# EAGLE design node_with_dpl_and_relay (EAGLE 6.5.0)
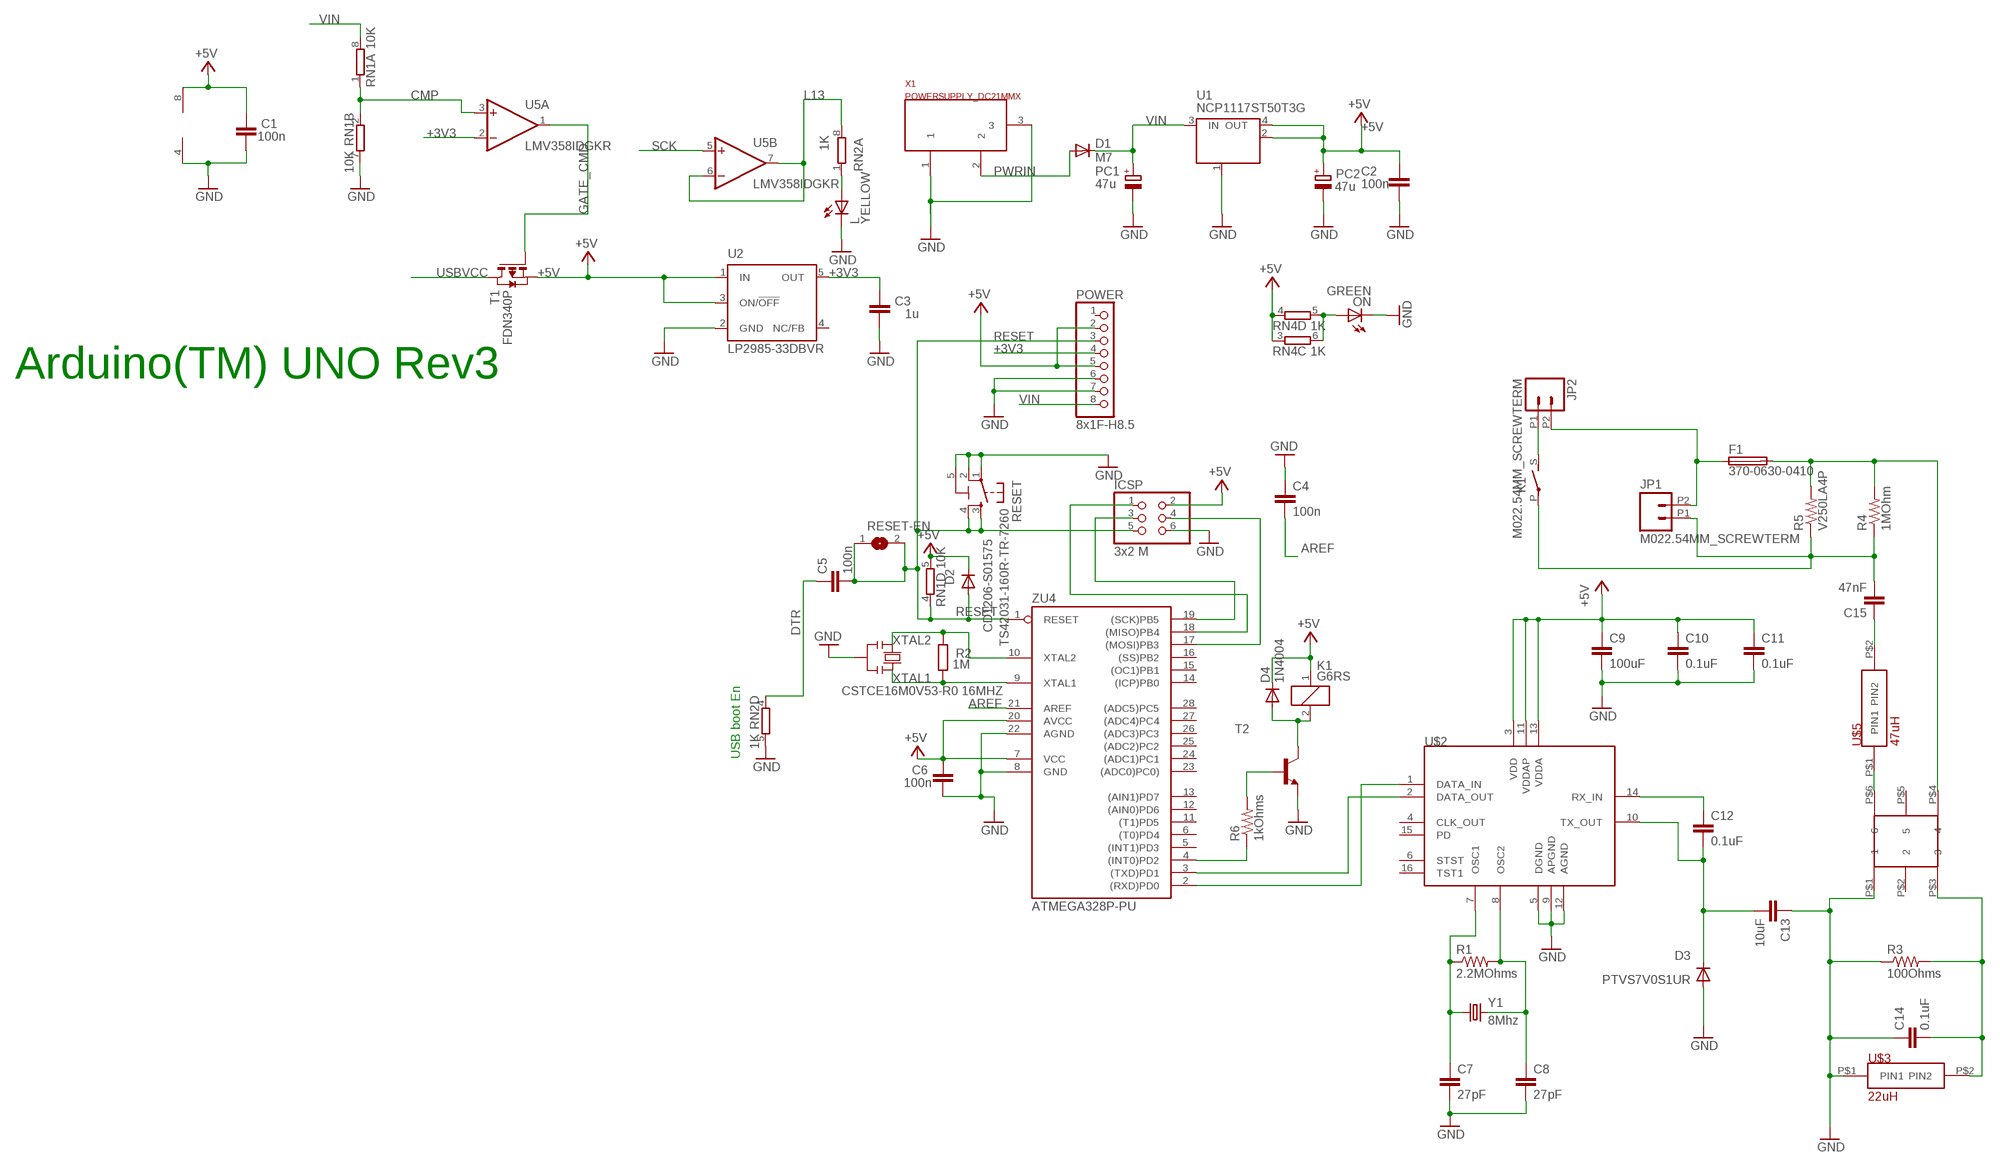
[diagram p0: schematic, sheet 1]

## Parts
C1  100n  C-EU0603-RND  [C0603-ROUND]
C2  100n  C-EU0603-RND  [C0603-ROUND]
C3  1u  C-EU0603-RND  [C0603-ROUND]
C4  100n  C-EU0603-RND  [C0603-ROUND]
C5  100n  C-EU0603-RND  [C0603-ROUND]
C6  100n  C-EU0603-RND  [C0603-ROUND]
C7  27pF  CAP1206  [1206]
C8  27pF  CAP1206  [1206]
C9  100uF  CAP1206  [1206]
C10  0.1uF  CAP1206  [1206]
C11  0.1uF  CAP1206  [1206]
C12  0.1uF  CAP_  [AXIAL-5MM]
C13  10uF  CAPPTH  [CAP-PTH-SMALL]
C14  0.1uF  CAP1206  [1206]
C15  47nF  C15/5  [C15B5]
D1  M7  DIODE-SMB  [SMB]
D2  CD1206-S01575  DIODE-MINIMELF  [MINIMELF]
D3  PTVS7V0S1UR  CGRM4001-G  [SOD-123_MINI-SMA]
D4  1N4004  [DO41-10]
F1  370-0630-0410  TR5  [TR5]
ICSP  3x2 M  PINHD-2X3  [2X03]
JP1  M022.54MM_SCREWTERM  [1X02_2.54_SCREWTERM]
JP2  M022.54MM_SCREWTERM  [1X02_2.54_SCREWTERM]
K1  G6RS  [G6RS]
L  YELLOW  LEDCHIP-LED0805  [CHIP-LED0805]
ON  GREEN  LEDCHIP-LED0805  [CHIP-LED0805]
PC1  47u  CPOL-EUD  [PANASONIC_D]
PC2  47u  CPOL-EUD  [PANASONIC_D]
POWER  8x1F-H8.5  PINHD-1X8  [1X08]
R1  2.2MOhms  RESISTOR1206  [1206]
R2  1M  R-EU_R0603  [R0603-ROUND]
R3  100Ohms  RESISTORPTH-1/2W  [AXIAL-0.5]
R4  1MOhm  10KOHM1/6W5%(PTH)KIT  [AXIAL-0.3-KIT]
R5  V250LA4P  RESISTORPTH-1/4W  [AXIAL-0.4]
R6  1kOhms  R-US_0204/2V  [0204V]
RESET  TS42031-160R-TR-7260  TS42  [TS42]
RESET-EN  SJ  [SJ]
RN1  10K  4R-NCAY16  [CAY16]
RN2  1K  4R-NCAY16  [CAY16]
RN4  1K  4R-NCAY16  [CAY16]
T1  FDN340P  PMOSSOT23  [SOT-23]
T2  2N5401-NPN-TO92-CBE  [TO92-CBE]
U1  NCP1117ST50T3G  MC33269ST-3.3T3  [SOT223]
U2  LP2985-33DBVR  LP2985-XXDBVR33  [SOT23-DBV]
U5  LMV358IDGKR  LMV358MMX  [MSOP08]
U$2  TDA5052AT  [SO16L]
U$3  22uH  RFB0807-220L  [RFB0807-220L]
U$4  78250MC  [78250MC]
U$5  47uH  RFB0807-220L  [RFB0807-220L]
X1  POWERSUPPLY_DC21MMX  [POWERSUPPLY_DC-21MM]
Y1  8Mhz  CRYSTALHC49US  [HC49US]
Y2  CSTCE16M0V53-R0 16MHZ  RESONATORMU  [RESONATOR]
ZU4  ATMEGA328P-PU  [DIL28-3]

## Nets
+3V3: C3.2 POWER.4 U2.5(OUT) U5.2(A:-IN)
+5V [usbvcc]: C1.2 C2.2 C6.2 C9.1 C10.1 C11.1 D2.C D4.C ICSP.2 K1.1 PC2.+ POWER.2 POWER.5 RN1.5 RN4.3 RN4.4 T1.2(S) U1.2(OUT) U1.4(OUT) U2.1(IN) U2.3(ON/!OFF) U5.8(P:V+) U$2.3(VDD) U$2.11(VDDAP) U$2.13(VDDA) ZU4.7(VCC) ZU4.20(AVCC)
AREF [aref]: C4.2 ZU4.21(AREF)
CMP: RN1.1 RN1.2 U5.3(A:+IN)
DTR: C5.1 RN2.4
GATE_CMD: T1.3(G) U5.1(A:OUT)
GND [gnd]: C1.1 C2.1 C3.1 C4.1 C6.1 C7.2 C8.2 C9.2 C10.2 C11.2 C13.1 C14.1 D3.A ICSP.6 L.C ON.C PC1.- PC2.- POWER.6 POWER.7 R3.P$1 RESET.1 RESET.2 RESET.5(5-GND) RN1.7 RN2.5 T2.E U1.1(GND/ADJ) U2.2(GND) U5.4(P:V-) U$2.5(DGND) U$2.9(APGND) U$2.12(AGND) U$3.P$1(PIN1) U$4.P$1 X1.1 X1.3 Y2.2 ZU4.8(GND) ZU4.22(AGND)
L13: RN2.8 U5.6(B:-IN) U5.7(B:OUT)
MISO: ICSP.1 ZU4.18((MISO)PB4)
MOSI: ICSP.4 ZU4.17((MOSI)PB3)
N$1: L.A RN2.1
N$2: C8.1 R1.2 U$2.8(OSC2) Y1.2
N$3: ON.A RN4.5 RN4.6
N$4: C7.1 R1.1 U$2.7(OSC1) Y1.1
N$5: C12.P$1 U$2.14(RX_IN)
N$6: C12.P$2 C13.2 D3.C U$2.10(TX_OUT)
N$7: C14.2 R3.P$2 U$3.P$2(PIN2) U$4.P$3
N$8: U$4.P$6 U$5.P$1(PIN1)
N$9: C15.1 U$5.P$2(PIN2)
N$10: F1.2 R4.P$2 R5.P$2 U$4.P$4
N$11: JP2.P1 K1.S(2:S)
N$12: F1.1 JP1.P2 JP2.P2
N$13: U$2.2(DATA_OUT) ZU4.3((TXD)PD1)
N$14: U$2.1(DATA_IN) ZU4.2((RXD)PD0)
N$15: R6.1 ZU4.4((INT0)PD2)
N$16: R6.2 T2.B
N$17: D4.A K1.2 T2.C
N$19: C15.2 JP1.P1 K1.P(2:P) R4.P$1 R5.P$1
PWRIN [power]: D1.A X1.2
RESET: C5.2 D2.A ICSP.5 POWER.3 RESET-EN.1 RESET-EN.2 RESET.3 RESET.4 RN1.4 ZU4.1(RESET)
SCK: ICSP.3 U5.5(B:+IN) ZU4.19((SCK)PB5)
USBVCC [usbvcc]: T1.1(D)
VIN [power]: D1.C PC1.+ POWER.8 RN1.8 U1.3(IN)
XTAL1: R2.1 Y2.3 ZU4.9(XTAL1)
XTAL2: R2.2 Y2.1 ZU4.10(XTAL2)
Unconnected: POWER.1 RN1.3 RN1.6 RN2.2 RN2.3 RN2.6 RN2.7 RN4.1 RN4.2 RN4.7 RN4.8 U2.4(NC/FB) U$2.4(CLK_OUT) U$2.6(STST) U$2.15(PD) U$2.16(TST1) U$4.P$2 U$4.P$5 ZU4.5((INT1)PD3) ZU4.6((T0)PD4) ZU4.11((T1)PD5) ZU4.12((AIN0)PD6) ZU4.13((AIN1)PD7) ZU4.14((ICP)PB0) ZU4.15((OC1)PB1) ZU4.16((SS)PB2) ZU4.23((ADC0)PC0)) ZU4.24((ADC1)PC1) ZU4.25((ADC2)PC2) ZU4.26((ADC3)PC3) ZU4.27((ADC4)PC4) ZU4.28((ADC5)PC5)

## Notes on the sheet
- Arduino(TM) UNO Rev3
- USB boot En

## Library data of the parts
C1-C6 = SmartPrj:C-EU: CAPACITOR, European symbol
C7-C12 C14 = SparkFun-Passives:CAP: Capacitor Standard 0603 ceramic capacitor, and 0.1" leaded capacitor.
C13 = SparkFun-Capacitors:CAP: Capacitor Standard 0603 ceramic capacitor, and 0.1" leaded capacitor.
C15 = capacitor-wima:C: CAPACITOR naming: grid - package width
D1 D2 = diode:DIODE-: DIODE
D3 = diode:CGRM400*-G: Molded plasitc,JEDEC SOD-123/Mini SMA Source: Comchip CGRM4001-G.pdf
D4 = diode:1N4004: DIODE general purpose rectifier, 1 A
F1 = fuse:TR5: FUSE Wickmann; OC_FARNELL: unknown; OC_NEWARK: unknown
ICSP = SmartPrj:PINHD-2X3: PIN HEADER
JP1 JP2 = SparkFun-Connectors:M02: Standard 2-pin 0.1" header. Use with - straight break away headers ( PRT-00116) - right angle break away headers (PRT-00553) - swiss pins (PRT-00743) - machine pins (PRT-00117) - female headers (PRT-00115) Molex polarized connector foot print use with: PRT-08233 with associated crimp pins and housings. 2.54_SCREWTERM for use with PRT-10571. 3.5mm Screw Terminal footprints for PRT-08084 5mm Screw Terminal footprints for use with PRT-08433
K1 = relay:G6RS: RELAY 1 x norm. open, Omron; OC_FARNELL: unknown; OC_NEWARK: unknown
L ON = led:LED: LED OSRAM: - CHIPLED LG R971, LG N971, LY N971, LG Q971, LY Q971, LO R971, LY R971 LH N974, LH R974 LS Q976, LO Q976, LY Q976 LO Q996 - Hyper CHIPLED LW Q18S LB Q993, LB Q99A, LB R99A - SideLED LS A670, LO A670, LY A670, LG A670, LP A670 LB A673, LV A673, LT A673, LW A673 LH A674 LY A675 LS A676, LA A676, LO A676, LY A676, LW A676 LS A679, LY A679, LG A679 - Hyper Micro SIDELED® LS Y876, LA Y876, LO Y876, LY Y876 LT Y87S - SmartLED LW L88C, LW L88S LB L89C, LB L89S, LG L890 LS L89K, LO L89K, LY L89K LS L896, LA L896, LO L896, LY L896 - TOPLED LS T670, LO T670, LY T670, LG T670, LP T670 LSG T670, LSP T670, LSY T670, LOP T670, LYG T670 LG T671, LOG T671, LSG T671 LB T673, LV T673, LT T673, LW T673 LH T674 LS T676, LA T676, LO T676, LY T676, LB T676, LH T676, LSB T676, LW T676 LB T67C, LV T67C, LT T67C, LS T67K, LO T67K, LY T67K, LW E67C LS E67B, LA E67B, LO E67B, LY E67B, LB E67C, LV E67C, LT E67C LW T67C LS T679, LY T679, LG T679 LS T770, LO T770, LY T770, LG T770, LP T770 LB T773, LV T773, LT T773, LW T773 LH T774 LS E675, LA E675, LY E675, LS T675 LS T776, LA T776, LO T776, LY T776, LB T776 LHGB T686 LT T68C, LB T68C - Hyper Mini TOPLED® LB M676 - Mini TOPLED Santana® LG M470 LS M47K, LO M47K, LY M47K Source: http://www.osram.convergy.de LUXEON: - LUMILED® LXK2-PW12-R00, LXK2-PW12-S00, LXK2-PW14-U00, LXK2-PW14-V00 LXK2-PM12-R00, LXK2-PM12-S00, LXK2-PM14-U00 LXK2-PE12-Q00, LXK2-PE12-R00, LXK2-PE12-S00, LXK2-PE14-T00, LXK2-PE14-U00 LXK2-PB12-K00, LXK2-PB12-L00, LXK2-PB12-M00, LXK2-PB14-N00, LXK2-PB14-P00, LXK2-PB14-Q00 LXK2-PR12-L00, LXK2-PR12-M00, LXK2-PR14-Q00, LXK2-PR14-R00 LXK2-PD12-Q00, LXK2-PD12-R00, LXK2-PD12-S00 LXK2-PH12-R00, LXK2-PH12-S00 LXK2-PL12-P00, LXK2-PL12-Q00, LXK2-PL12-R00 Source: www.luxeon.com KINGBRIGHT: KA-3528ASYC Source: www.kingbright.com
PC1 PC2 = rcl:CPOL-EU: POLARIZED CAPACITOR, European symbol
POWER = SmartPrj:PINHD-1X8: PIN HEADER
R1 R5 = SparkFun-Passives:RESISTOR: Resistor Basic schematic elements and footprints for 0603, 1206, and PTH resistors.
R2 = SmartPrj:R-EU_: RESISTOR, European symbol
R3 = SparkFun-Resistors:RESISTOR: Resistor Basic schematic elements and footprints for 0603, 1206, and PTH resistors.
R4 = SparkFun-Resistors:10KOHM1/6W5%(PTH): RES-08375; PROD_ID: RES-08375
R6 = resistor:R-US_: RESISTOR, American symbol
RESET = SmartPrj:TS42: TS42 Dongnan Electronics Tact switch VDC 12V - 50mA
RESET-EN = jumper:SJ: SMD solder JUMPER
RN1 RN2 RN4 = resistor-dil:4R-N: Array Chip Resistor Source: RS Component / Phycomp
T1 = zetex:PMOSSOT23: MOS FET
T2 = transistor:*-NPN-: NPN Transistror BF959 corrected 2008.03.06
U1 = linear:MC33269ST*: Adjustable Output Low Dropout Voltage Regulator 800 mA Source: http://www.onsemi.com/pub/Collateral/MC33269-D.PDF
U2 = SmartPrj:LP2985-XXDBVR: ULTRALOW-POWER 50-mA LOW-DROPOUT LINEAR REGULATORS 50-mA Low-Dropout Regulator Source: http://focus.ti.com/lit/ds/symlink/tps77001.pdf
U5 = linear:LMV358?*: Dual General Purpose, Low Voltage, Rail-to-Rail Output Operational Amplifiers Source: http://www.national.com/mpf/LM/LMV321.html http://www.national.com/dt/lmv_qual.pdf
U$2 = Power_Modem:TDA5052AT
U$3 U$5 = Coilcraft_Inductors:RFB0807-220L
U$4 = Murata_Transformers:78250MC
X1 = SmartPrj:POWERSUPPLY_DC21MM
Y1 = SparkFun-FreqCtrl:CRYSTAL: Various standard crystals. Proven footprints. Spark Fun Electronics SKU : COM-00534
Y2 = SmartPrj:RESONATOR
ZU4 = SmartPrj:ATMEGA328P-: MICROCONTROLLER 4 Kbytes FLASH 128 bytes SRAM 256 bytes EEPROM UART 6-channel 10 bit ADC

## Net classes
0 default: width 0.254 mm, clearance 0.254 mm
1 power: width 0.61 mm, drill 0.61 mm, clearance 0.254 mm
2 gnd: width 0.305 mm, drill 0.559 mm, clearance 0.254 mm
3 usbvcc: width 0.508 mm, drill 0.61 mm, clearance 0.254 mm
4 aref: width 0.406 mm, drill 0.61 mm, clearance 0.254 mm

## Board
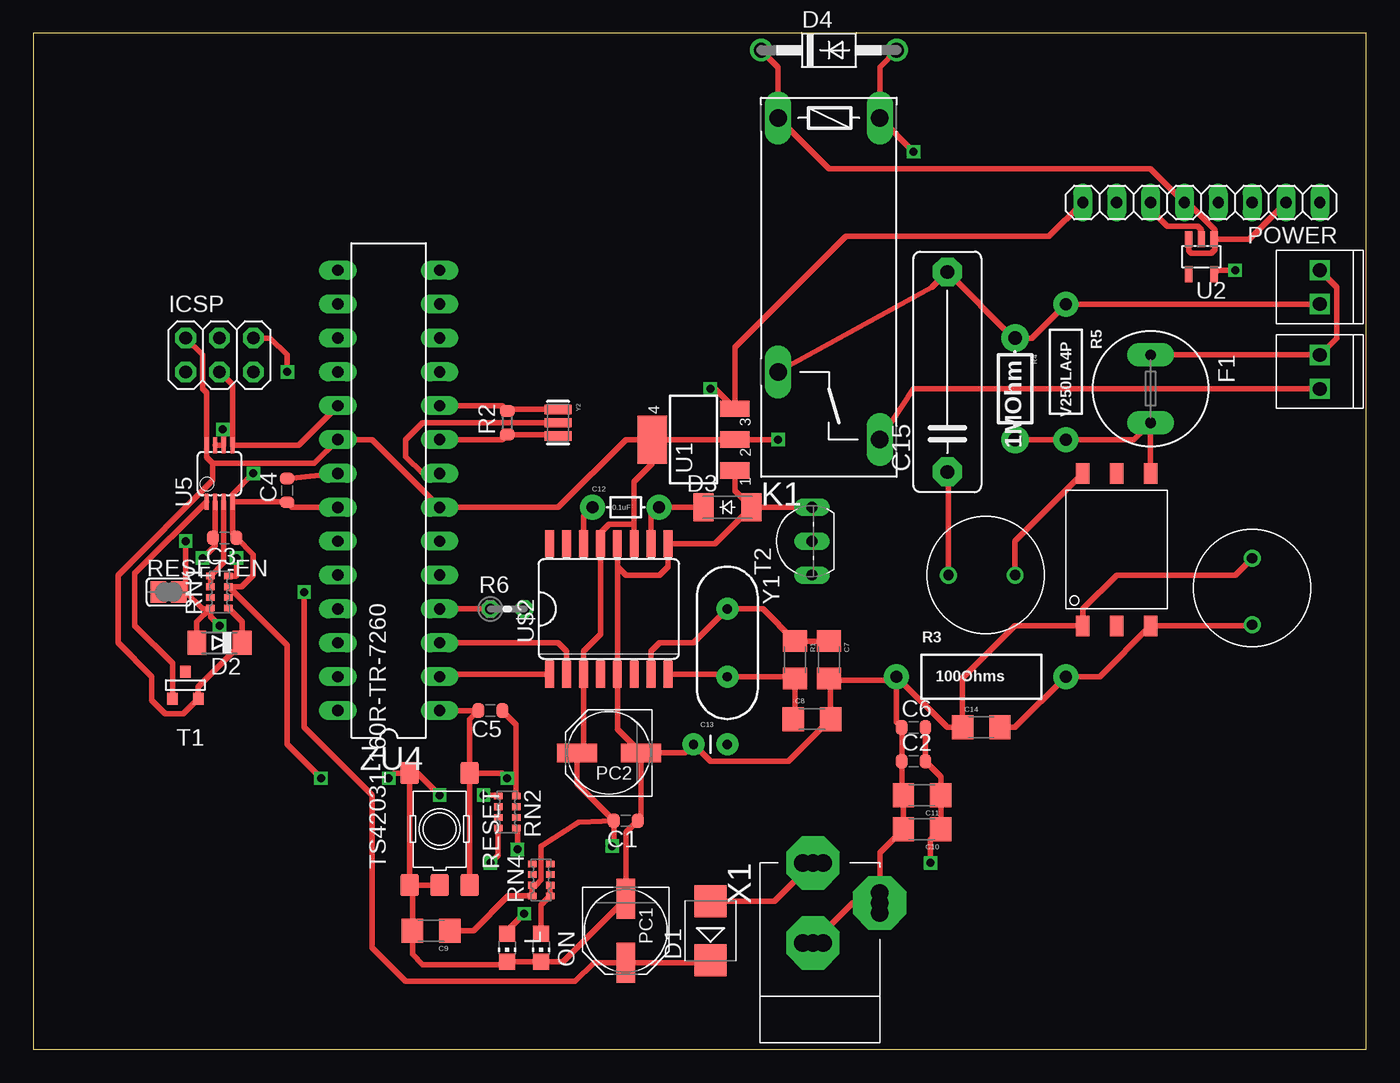
[diagram p1: board, top side]
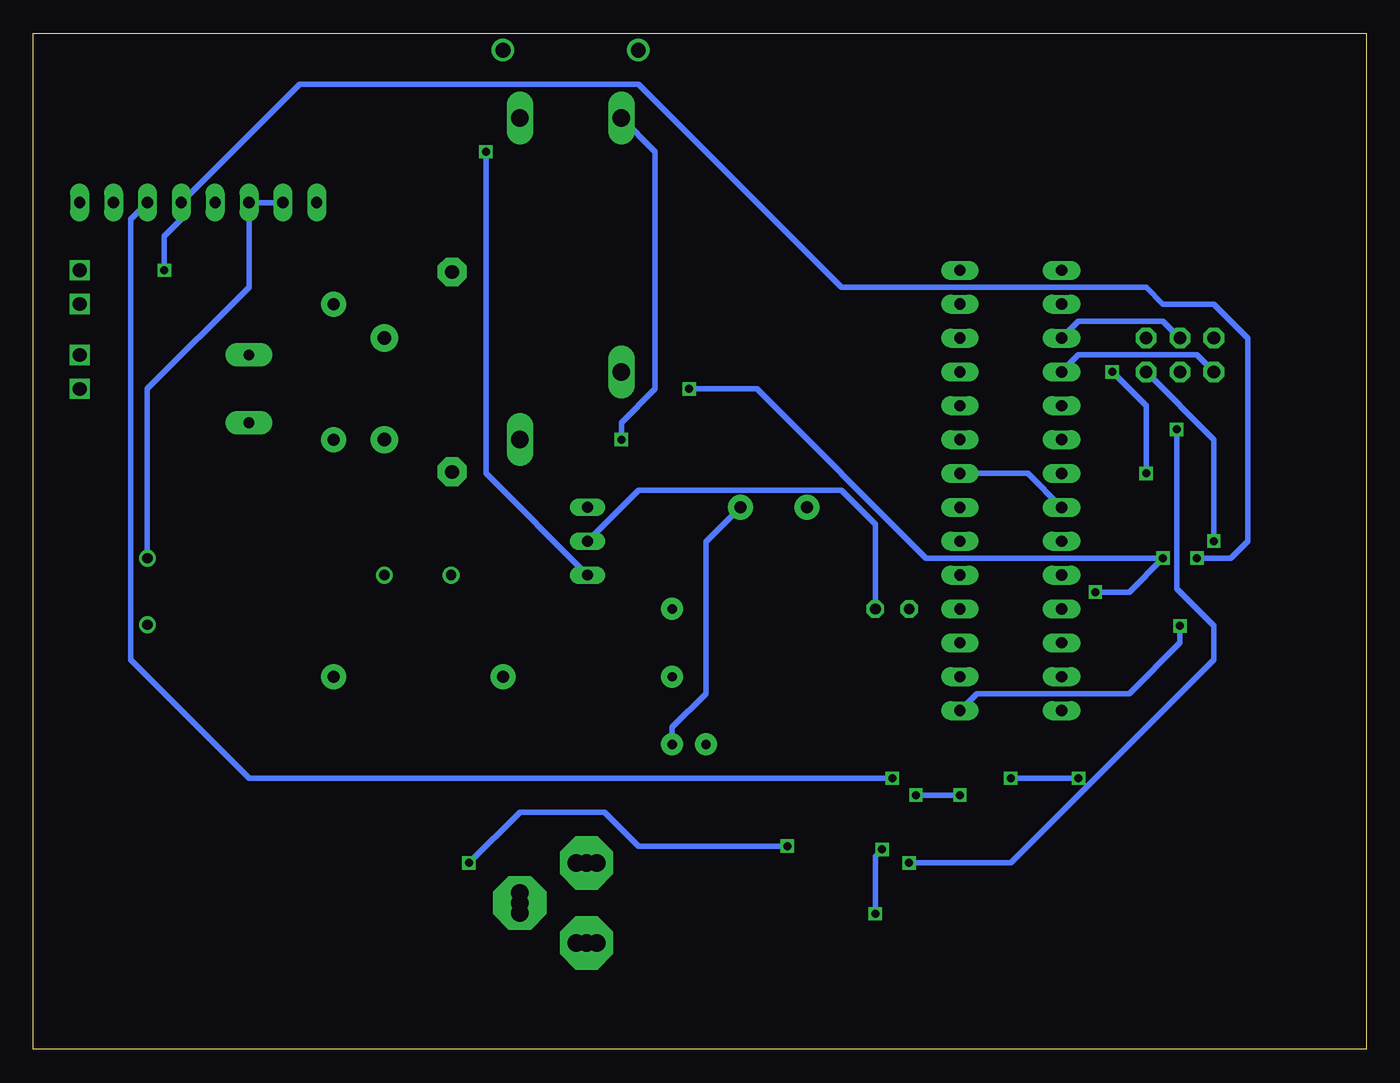
[diagram p2: board, bottom side, seen from below]

Size 100 x 76.19 mm. Coordinates in mm from the lower left corner, seen from the top.
Outline: 0,0 100,0 100,76.19 0,76.19 0,0
Copper layers (1*16): Top 0.035mm / dielectric 1.5mm / Bottom 0.035mm
Design rules "default": minimum track width 10mil, minimum drill 24mil, track to track 8mil, track to pad 8mil, pad to pad 8mil, via to via 8mil, smd to smd 8mil, copper to edge 40mil, drill to drill 8mil, minimum pad ring 10mil, minimum via ring 8mil, stop-mask expansion 4mil, vias tented up to drill 0mil, thermal gap 10mil

### Footprints (pad centres in the part's own frame; a part is rotated, then mirrored left to right if it is on the bottom)
C0603-ROUND = smd 0.898 x 1.1: 1 -0.889,0; 2 0.889,0
1206 = smd 1.6 x 1.8: 1 -1.4,0; 2 1.4,0
AXIAL-5MM = drill 0.9 pad 1.88: P$1 -2.5,0; P$2 2.5,0
CAP-PTH-SMALL = drill 0.7 pad 1.651: 1 0,0; 2 2.54,0
C15B5 = drill 1.016 pad 2.159 octagon: 1 -7.493,0; 2 7.493,0
SMB = smd 2.4 x 2.4: A 2.2,0; C -2.2,0
MINIMELF = smd 1.4 x 1.8: A 1.7,0; C -1.7,0
SOD-123_MINI-SMA = smd 1.5 x 2.1: A 1.8,0; C -1.8,0
DO41-10 = drill 1.118: A 5.08,0; C -5.08,0
TR5 = drill 0.813 pad 1.778 long: 1 -2.54,0; 2 2.54,0
2X03 = drill 0.95 pad 1.55 octagon: 1 -2.54,-1.27; 2 -2.54,1.27; 3 0,-1.27; 4 0,1.27; 5 2.54,-1.27; 6 2.54,1.27
1X02_2.54_SCREWTERM = drill 1.016 square: P1 2.54,0; P2 0,0
G6RS = drill 1.321 long: 1 -12.7,-3.81; 2 -12.7,3.81; P 6.35,-3.81; S 11.43,3.81
CHIP-LED0805 = smd 1.2 x 1.2: A 0,-1.05; C 0,1.05
PANASONIC_D = smd 3 x 1.4: + 2.4,0; - -2.4,0
1X08 = drill 0.85 pad 1.422 long: 1 -8.89,0; 2 -6.35,0; 3 -3.81,0; 4 -1.27,0; 5 1.27,0; 6 3.81,0; 7 6.35,0; 8 8.89,0
R0603-ROUND = smd 0.898 x 1.1: 1 -0.889,0; 2 0.889,0
AXIAL-0.5 = drill 0.9 pad 1.88: P$1 -6.35,0; P$2 6.35,0
AXIAL-0.3-KIT = drill 1.016 pad 2.032: P$1 -3.81,0; P$2 3.81,0
AXIAL-0.4 = drill 0.9 pad 1.88: P$1 -5.08,0; P$2 5.08,0
0204V = drill 0.813 octagon: 1 -1.27,0; 2 1.27,0
TS42 = smd 1.6 x 1.4: 1 -4.2,2.25; 2 4.2,2.25; 3 -4.2,-2.25; 4 4.2,-2.25; 5 -4.2,0
SJ = smd 1.168 x 1.6: 1 -0.762,0; 2 0.762,0
CAY16 = smd 0.5 x 0.65: 1 -1.2,-0.675; 2 -0.4,-0.675; 3 0.4,-0.675; 4 1.2,-0.675; 5 1.2,0.675; 6 0.4,0.675; 7 -0.4,0.675; 8 -1.2,0.675
SOT-23 = smd 0.787 x 0.889: 1 0.025,-1.016; 2 -0.94,1.016; 3 0.991,1.016
TO92-CBE = drill 0.813 long: B 0,0; C -2.54,0; E 2.54,0
SOT223 = smd 1.219 x 2.235: 1 -2.311,-3.099; 2 0,-3.099; 3 2.311,-3.099 | smd 3.6 x 2.2: 4 0,3.099
SOT23-DBV = smd 0.55 x 1.2: 1 -0.95,-1.3; 2 0,-1.3; 3 0.95,-1.3; 4 0.95,1.3; 5 -0.95,1.3
MSOP08 = smd 0.3 x 1.2: 1 -0.976,-2.113; 2 -0.326,-2.113; 3 0.324,-2.113; 4 0.974,-2.113; 5 0.974,2.112; 6 0.324,2.112; 7 -0.326,2.112; 8 -0.976,2.112
SO16L = smd 0.66 x 2.032: 1 -4.445,-4.902; 2 -3.175,-4.902; 3 -1.905,-4.902; 4 -0.635,-4.902; 5 0.635,-4.902; 6 1.905,-4.902; 7 3.175,-4.902; 8 4.445,-4.902; 9 4.445,4.902; 10 3.175,4.902; 11 1.905,4.902; 12 0.635,4.902; 13 -0.635,4.902; 14 -1.905,4.902; 15 -3.175,4.902; 16 -4.445,4.902
RFB0807-220L = drill 0.762: P$1 0,0; P$2 5.004,0
78250MC = smd 1.524 x 1.016: P$1 0,0; P$2 0,-2.54; P$3 0,-5.08; P$4 11.43,-5.08; P$5 11.43,-2.54; P$6 11.43,0
POWERSUPPLY_DC-21MM = drill 1.3 pad 4 octagon: 1 -5.08,-3.353; 2 -0.076,-6.35; 3 -0.076,-0.356 | drill 1.3: 4 -5.08,-4.115; 5 -5.08,-2.591; 6 -0.838,-0.356; 7 0.686,-0.356; 8 -0.838,-6.35; 9 0.686,-6.35
HC49US = drill 0.7 pad 1.651: 1 -2.54,0; 2 2.54,0
RESONATOR = smd 0.7 x 2: 1 -1,0; 2 0,0; 3 1,0
DIL28-3 = drill 0.85 pad 1.422 long: 1 -16.51,-3.81; 2 -13.97,-3.81; 3 -11.43,-3.81; 4 -8.89,-3.81; 5 -6.35,-3.81; 6 -3.81,-3.81; 7 -1.27,-3.81; 8 1.27,-3.81; 9 3.81,-3.81; 10 6.35,-3.81; 11 8.89,-3.81; 12 11.43,-3.81; 13 13.97,-3.81; 14 16.51,-3.81; 15 16.51,3.81; 16 13.97,3.81; 17 11.43,3.81; 18 8.89,3.81; 19 6.35,3.81; 20 3.81,3.81; 21 1.27,3.81; 22 -1.27,3.81; 23 -3.81,3.81; 24 -6.35,3.81; 25 -8.89,3.81; 26 -11.43,3.81; 27 -13.97,3.81; 28 -16.51,3.81

### Placement (x,y rotation side)
C1  44.45,17.14 180 top
C2  66.04,21.59 0 top
C3  14.35,38.35 180 top
C4  19.05,41.91 90 top
C5  34.29,25.4 180 top
C6  66.04,24.13 0 top
C7  59.69,29.21 270 top
C8  58.42,24.77 0 top
C9  29.84,8.89 180 top
C10  66.67,16.51 180 top
C11  66.67,19.05 180 top
C12  44.45,40.64 0 top
C13  49.53,22.86 0 top
C14  71.12,24.13 0 top
C15  68.58,50.8 90 top
D1  50.8,8.89 90 top
D2  13.97,30.48 180 top
D3  52.07,40.64 0 top
D4  59.69,74.93 0 top
F1  83.82,49.53 270 top
ICSP  13.97,52.07 0 top
JP1  96.52,58.42 270 top
JP2  96.52,52.07 270 top
K1  59.69,57.15 270 top
L  35.56,7.62 180 top
ON  38.1,7.62 180 top
PC1  44.45,8.89 270 top
PC2  43.18,22.22 180 top
POWER  87.63,63.5 180 top
R1  57.15,29.21 270 top
R2  35.56,46.99 90 top
R3  71.12,27.94 0 top
R4  73.66,49.53 270 top
R5  77.47,50.8 270 top
R6  35.56,33.02 0 top
RESET  30.48,16.51 90 top
RESET-EN  10.16,34.29 0 top
RN1  13.97,34.29 270 top
RN2  35.56,17.78 90 top
RN4  38.1,12.7 270 top
T1  11.43,27.3 180 top
T2  58.42,38.1 90 top
U1  49.53,45.72 90 top
U2  87.63,59.44 180 top
U5  13.97,43.18 0 top
U$2  43.18,33.02 0 top
U$3  91.44,36.83 270 top
U$4  78.74,31.75 90 top
U$5  73.66,35.56 180 top
X1  58.42,7.62 180 top
Y1  52.07,30.48 270 top
Y2  39.37,46.99 270 top
ZU4  26.67,41.91 90 top

### Tracks (layer width: path | path; a pad name or v marks a point on that pad's centre or on a via)
+3V3  (via drill 0.6)
  Top 0.406: C3.2 13.64,38.54 U5.2 13.64,37.77 v12.7,36.83 | v90.17,58.42 88.86,58.42 U2.5
  Bottom 0.406: v90.17,58.42 90.17,60.96 88.9,62.23 POWER.4 80.01,72.39 54.61,72.39 39.37,57.15 16.51,57.15 15.24,55.88 11.43,55.88 8.89,53.34 8.89,38.1 10.16,36.83 v12.7,36.83
+5V  (via drill 0.6)
  Top 0.406: U1.4 U1.2 v55.88,45.72 | U1.4 46.43,43.89 45.08,42.55 45.08,39.37 | 45.08,39.37 U$2.11 | U1.4 44.45,45.72 39.37,40.64 ZU4.7 25.4,45.72 ZU4.20 21.08,43.94 13.46,43.94 | 45.08,39.37 43.18,39.37 42.54,38.73 U$2.13 42.54,31.11 41.27,29.84 U$2.3 41.27,22.72 PC2.+ 40.78,19.93 C1.2 | C9.1 33.02,8.89 35.63,11.5 RN4.4 RN4.3 37.7,12.3 38.1,12.7 38.1,15.24 40.89,17.02 C1.2 | C6.2 C2.2 68.08,20.44 C11.1 C10.1 67.31,15.75 v67.31,13.97 | D4.C 55.88,73.66 K1.1 59.69,66.04 83.82,66.04 POWER.5 86.61,63.5 88.65,61.47 88.65,60.8 U2.1 | RN1.5 15.67,32.06 D2.C 12.37,27.18 T1.2 11.23,25.15 9.91,25.15 8.89,26.16 8.89,27.94 6.35,30.48 6.35,35.56 13.46,42.67 13.46,43.94 | 13.46,43.94 12.99,44.41 U5.8 12.99,49.24 12.7,49.53 12.7,52.07 ICSP.2 | U2.3 86.68,59.88 86.87,59.69 88.39,59.69 88.65,59.94 88.65,60.67 U2.1 | U2.1 91.22,60.74 POWER.2 | C1.2 43.56,15.37 v43.43,15.24
  Bottom 0.406: v55.88,45.72 55.88,46.99 53.34,49.53 53.34,67.31 K1.1 | v43.43,15.24 54.61,15.24 57.15,17.78 63.5,17.78 v67.31,13.97
AREF
  Top 0.406: C4.2 ZU4.21
CMP
  Top 0.406: U5.3 14.29,36.49 RN1.1 RN1.2
DTR
  Top 0.406: RN2.4 36.23,24.34 C5.1
GATE_CMD
  Top 0.406: T1.3 10.44,28.93 7.62,31.75 7.62,35.69 U5.1
GND  (via drill 0.6)
  Top 0.406: D3.A 51.15,37.92 U$2.9 47.62,36.2 46.99,35.56 44.45,35.56 43.81,36.2 U$2.12 U$2.5 43.81,23.99 PC2.- | U1.1 52.63,41.88 D3.A | PC2.- 45.58,17.39 C1.1 44.45,16.26 PC1.- 39.73,6.57 ON.C L.C 35.34,6.35 29.21,6.35 28.45,7.12 C9.2 28.45,12.09 | PC2.- 48.89,22.22 C13.1 50.8,21.59 56.64,21.59 C8.2 59.82,27.68 | 59.82,27.68 C7.2 | ZU4.22 19.43,40.64 C4.1 19,41.07 U5.4 | 28.45,12.09 RESET.1 RESET.2 | 59.82,27.68 64.51,27.68 R3.P$1 | R3.P$1 64.77,24.51 C6.1 C2.1 65.15,19.17 C11.2 C10.2 63.5,14.73 X1.1 61.49,10.97 X1.3 | R3.P$1 68.58,24.13 C14.1 69.72,27.81 73.66,31.75 U$4.P$1 78.74,33.02 81.28,35.56 90.17,35.56 U$3.P$1 | D3.A T2.E | U5.4 14.94,38.65 C3.1 16.51,37.08 16.51,35.56 15.64,34.69 RN1.7 19.05,30.29 19.05,22.86 v21.59,20.32 | POWER.6 83.82,62.99 85.09,61.72 87.38,61.72 87.63,61.47 U2.2 | ZU4.8 29.21,43.18 27.94,44.45 27.94,45.72 29.21,46.99 Y2.2 | RESET.2 28.82,20.71 v30.48,19.05 | v33.78,19.05 34.81,19.05 RN2.5 | U5.4 14.94,41.61 v16.51,43.18 | v19.05,50.8 19.05,52.07 17.78,53.34 ICSP.6 | v26.67,20.32 27.06,20.71 RESET.2 | 28.45,12.09 28.66,12.31 RESET.5
  Bottom 0.406: U$3.P$1 91.44,49.53 83.82,57.15 POWER.6 POWER.7 | ZU4.8 25.4,43.18 ZU4.22 | v30.48,19.05 v33.78,19.05 | v16.51,43.18 16.51,48.26 v19.05,50.8 | v21.59,20.32 v26.67,20.32
L13  (via drill 0.6)
  Top 0.406: U5.7 U5.6 14.29,46.41 v14.22,46.48 | v34.29,13.97 34.88,14.57 RN2.8
  Bottom 0.406: v14.22,46.48 14.22,34.54 11.43,31.75 11.43,29.21 26.67,13.97 v34.29,13.97
MISO
  Bottom 0.406: ICSP.1 12.7,52.07 21.59,52.07 ZU4.18
MOSI
  Bottom 0.406: ICSP.4 15.24,54.61 21.59,54.61 ZU4.17
N$1  (via drill 0.6)
  Top 0.406: L.A 35.56,8.89 v36.83,10.16 | v36.32,14.99 36.32,16.49 RN2.1
  Bottom 0.406: v36.83,10.16 36.83,14.48 v36.32,14.99
N$2
  Top 0.406: U$2.8 51.89,28.12 Y1.2 57.02,27.94 R1.2 57.15,24.89 C8.1
N$3
  Top 0.406: ON.A 38.1,10.82 RN4.5 RN4.6
N$4
  Top 0.406: U$2.7 46.35,29.84 46.99,30.48 49.53,30.48 Y1.1 54.74,33.02 R1.1 C7.1
N$5
  Top 0.406: U$2.14 41.27,39.96 C12.P$1
N$6
  Top 0.406: U$2.10 46.35,40.05 C12.P$2 D3.C
  Bottom 0.406: C13.2 52.07,24.13 49.53,26.67 49.53,38.06 C12.P$2
N$7
  Top 0.406: C14.2 73.66,24.13 R3.P$2 80.01,27.94 U$4.P$3 91.36,31.75 U$3.P$2
N$8
  Top 0.406: U$5.P$1 73.66,38.1 U$4.P$6
N$9
  Top 0.406: U$5.P$2 68.66,43.23 C15.1
N$10
  Top 0.406: R4.P$2 R5.P$2 82.55,45.72 F1.2 U$4.P$4
N$11
  Top 0.406: K1.S 66.04,49.53 JP2.P1
N$12
  Top 0.406: F1.1 JP2.P2 97.79,53.34 97.79,57.15 JP1.P2
N$13
  Top 0.406: ZU4.3 39.37,30.48 40,29.84 U$2.2
N$14
  Top 0.406: U$2.1 30.66,28.12 ZU4.2
N$15
  Top 0.406: ZU4.4 R6.1
N$16
  Bottom 0.406: R6.2 36.83,39.37 39.37,41.91 54.61,41.91 T2.B
N$17  (via drill 0.6)
  Top 0.406: D4.A 63.5,73.66 K1.2 v66.04,67.31
  Bottom 0.406: v66.04,67.31 66.04,43.18 T2.C
N$18  (via drill 0.6)
  other vias: 90.17,58.42
N$19
  Top 0.406: JP1.P1 R5.P$1 74.93,53.34 R4.P$1 73.53,53.34 C15.2 67.44,57.15 K1.P
N$20  (via drill 0.6)
  other vias: 15.24,36.83
N$23  (via drill 0.6)
  other vias: 13.97,31.75
N$24  (via drill 0.6)
  other vias: 55.88,45.72
PWRIN
  Top 0.406: D1.A 55.62,11.09 X1.2
RESET  (via drill 0.6)
  Top 0.406: ZU4.1 C5.2 32.73,24.73 RESET.4 | D2.A 12.27,32.06 RN1.4 | 11.43,34.29 RESET-EN.2 RESET-EN.1 | 11.43,34.29 12.7,33.02 13.22,33.02 RN1.4 | RESET.3 RESET.4 | RN1.4 13.29,32.43 v13.97,31.75 | 11.43,34.29 v11.43,38.1 | v35.56,20.32 35.17,20.71 RESET.4
  Bottom 0.406: v13.97,31.75 13.97,30.48 17.78,26.67 29.21,26.67 ZU4.1 | v11.43,38.1 11.43,45.72 ICSP.5 | POWER.3 92.71,62.23 92.71,29.21 83.82,20.32 v35.56,20.32
SCK
  Top 0.406: ZU4.19 19.89,45.29 U5.5 14.94,49.83 ICSP.3
VIN  (via drill 0.6)
  Top 0.406: D1.C 50.6,6.49 PC1.+ 42.05,6.49 40.64,5.08 27.94,5.08 25.4,7.62 25.4,19.05 20.32,24.13 v20.32,34.29 | POWER.8 76.2,60.96 60.96,60.96 52.63,52.63 U1.3 51.13,49.53 v50.8,49.53 | RN1.8 15.17,35.49 15.24,35.56 v15.24,36.83
  Bottom 0.406: v50.8,49.53 45.72,49.53 33.02,36.83 v15.24,36.83 17.78,34.29 v20.32,34.29
XTAL1
  Top 0.406: ZU4.9 35.18,45.72 R2.1 39.26,46.1 Y2.3
XTAL2
  Top 0.406: ZU4.10 35.18,48.26 R2.2 35.67,47.99 Y2.1